# Altium project StepperMotorDriver.PrjPcb
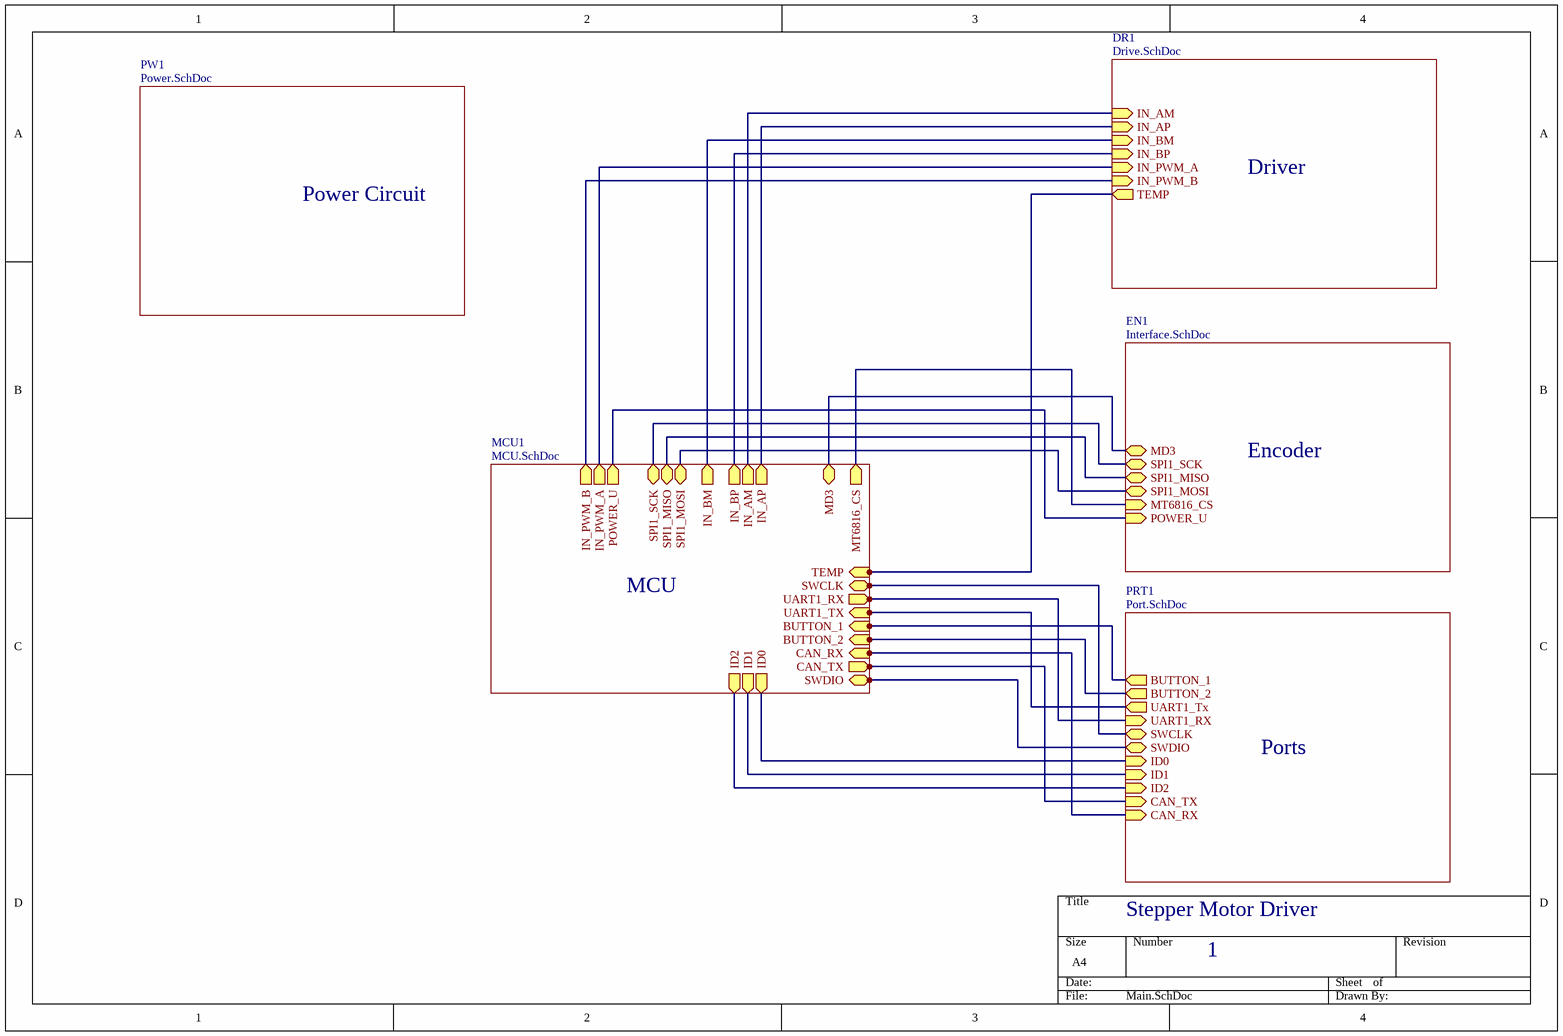
[diagram p0: Main.SchDoc]
6 sheets, 99 parts. Net scope: hierarchical (ports join the sheet entries above them; power ports are global).
Board file: PCB5.PcbDoc
Sheets:
  Main.SchDoc
    MCU1 = MCU.SchDoc
    DR1 = Drive.SchDoc
    EN1 = Interface.SchDoc
    PRT1 = Port.SchDoc
    PW1 = Power.SchDoc

## Sheet Main.SchDoc
size A4; SheetNumber: 1; SheetTotal: 6

### Sub-sheets
DR1 = Drive.SchDoc: IN_AM (in), IN_AP (in), IN_BM (in), IN_BP (in), IN_PWM_A (in), IN_PWM_B (in), TEMP (out)
EN1 = Interface.SchDoc: SPI1_SCK (bidir), SPI1_MISO (bidir), SPI1_MOSI (bidir), MT6816_CS (in), POWER_U (in), MD3 (bidir)
MCU1 = MCU.SchDoc: BUTTON_2 (in), SPI1_SCK (bidir), SPI1_MISO (bidir), SPI1_MOSI (bidir), UART1_TX (in), UART1_RX (out), CAN_RX (in), CAN_TX (out), IN_PWM_B (out), IN_PWM_A (out), BUTTON_1 (in), POWER_U (out), TEMP (in), IN_BM (out), IN_BP (out), IN_AM (out), IN_AP (out), ID0 (out), ID1 (out), ID2 (out), SWDIO (bidir), SWCLK (bidir), MT6816_CS (out), MD3 (bidir)
PRT1 = Port.SchDoc: BUTTON_1 (out), BUTTON_2 (out), UART1_Tx (out), UART1_RX (in), SWCLK (bidir), SWDIO (bidir), ID0 (in), ID1 (in), ID2 (in), CAN_TX (in), CAN_RX (in)
PW1 = Power.SchDoc: no entries

### Nets
NetC10_2: sheet MCU1/POWER_U, sheet EN1/POWER_U
NetC38_2: sheet MCU1/TEMP, sheet DR1/TEMP
NetJ1_5: sheet MCU1/SPI1_SCK, sheet EN1/SPI1_SCK
NetJ1_6: sheet MCU1/SPI1_MISO, sheet EN1/SPI1_MISO
NetJ1_7: sheet MCU1/SPI1_MOSI, sheet EN1/SPI1_MOSI
NetJ2_8: sheet MCU1/ID0, sheet PRT1/ID0
NetJ2_9: sheet MCU1/ID1, sheet PRT1/ID1
NetJ2_10: sheet MCU1/ID2, sheet PRT1/ID2
NetJ3_2: sheet MCU1/UART1_RX, sheet PRT1/UART1_RX
NetJ3_3: sheet MCU1/UART1_TX, sheet PRT1/UART1_Tx
NetJ3_4: sheet MCU1/SWDIO, sheet PRT1/SWDIO
NetJ3_5: sheet MCU1/SWCLK, sheet PRT1/SWCLK
NetR2_1: sheet MCU1/IN_PWM_A, sheet DR1/IN_PWM_A
NetR5_1: sheet MCU1/IN_PWM_B, sheet DR1/IN_PWM_B
NetS2_4: sheet MCU1/BUTTON_1, sheet PRT1/BUTTON_1
NetS3_4: sheet MCU1/BUTTON_2, sheet PRT1/BUTTON_2
NetU1_2: sheet MCU1/IN_AM, sheet DR1/IN_AM
NetU1_3: sheet MCU1/IN_AP, sheet DR1/IN_AP
NetU2_2: sheet MCU1/IN_BM, sheet DR1/IN_BM
NetU2_3: sheet MCU1/IN_BP, sheet DR1/IN_BP
NetU4_45: sheet MCU1/CAN_RX, sheet PRT1/CAN_RX
NetU4_46: sheet MCU1/CAN_TX, sheet PRT1/CAN_TX
(unnamed): sheet MCU1/MT6816_CS, sheet EN1/MT6816_CS
(unnamed): sheet MCU1/MD3, sheet EN1/MD3

### Notes on the sheet
- Driver
- Power Circuit
- Encoder
- MCU
- Ports
- Stepper Motor Driver
- 1

## Sheet MCU.SchDoc
size A4; SheetNumber: 4; SheetTotal: 6
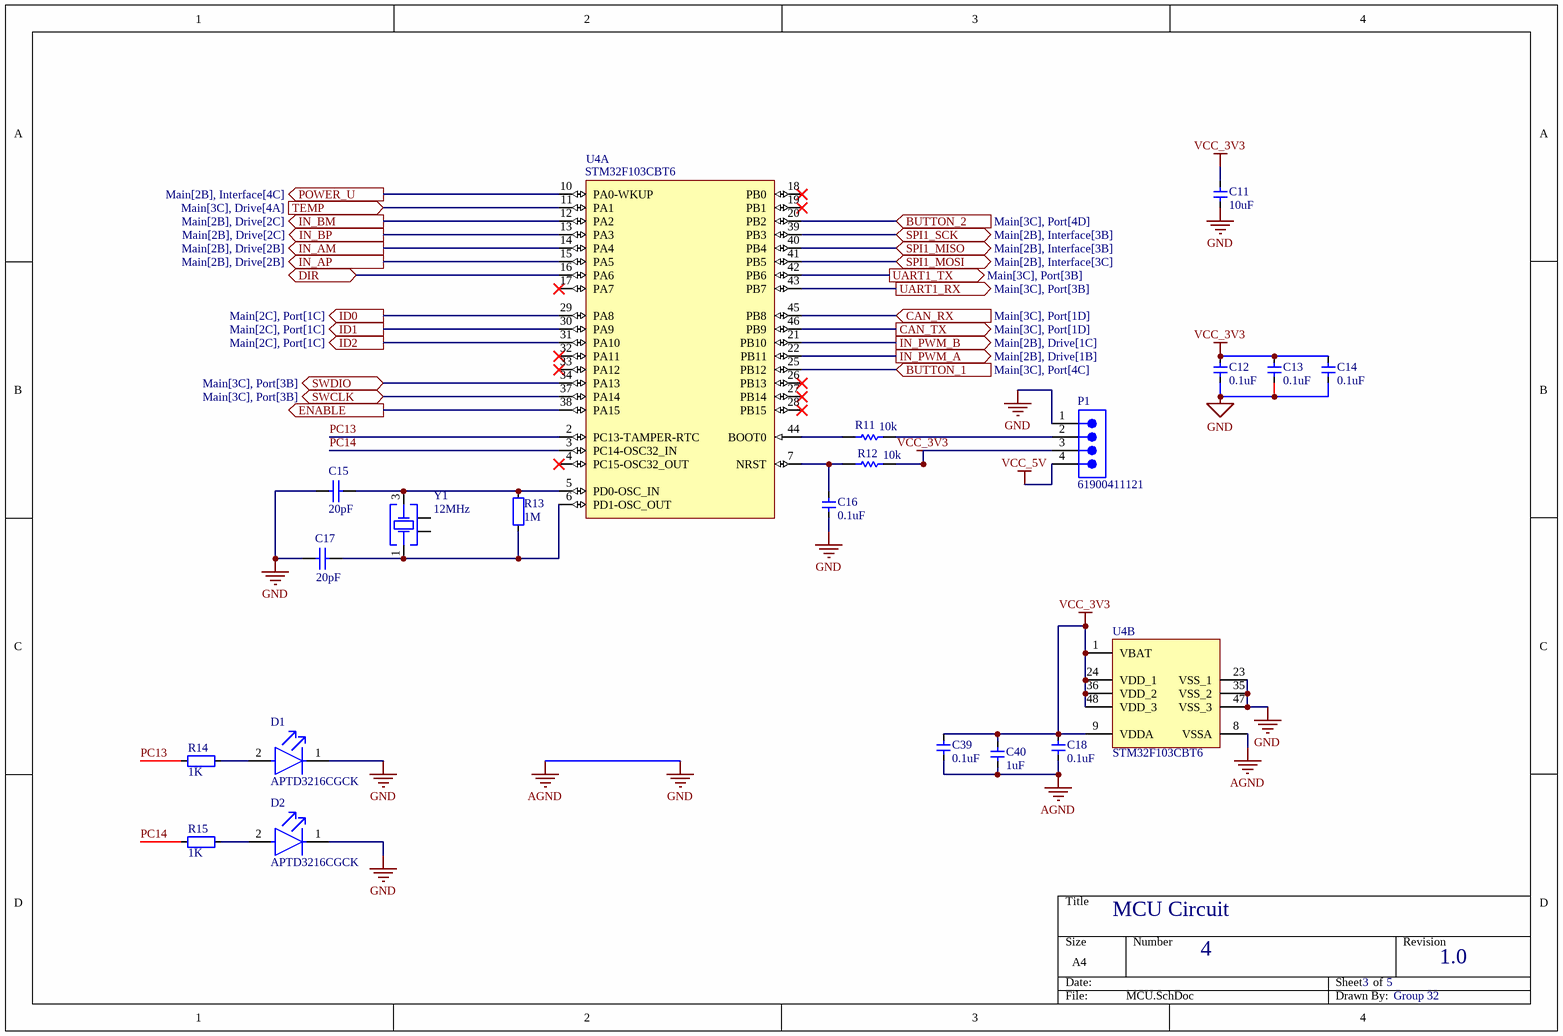
[diagram p1: MCU.SchDoc]

### Parts
C11  10uF  [CAPC2013X94X50LL20T25]
C12  0.1uF  [CAPC2013X94X50LL20T25]
C13  0.1uF  [CAPC2013X94X50LL20T25]
C14  0.1uF  [CAPC2013X94X50LL20T25]
C15  Resistance: 20pF  [CAPC2013X94X50LL20T25]  (hidden comment: 08055A200JAT2A)
C16  0.1uF  [CAPC2013X94X50LL20T25]
C17  Resistance: 20pF  [CAPC2013X94X50LL20T25]  (hidden comment: 08055A200JAT2A)
C18  0.1uF  [CAPC2013X94X50LL20T25]
C39  0.1uF  [CAPC2013X94X50LL20T25]
C40  1uF  [CAPC2013X94X50LL20T25]
D1  APTD3216CGCK  [FP-APTD3216CGCK-MFG]
D2  APTD3216CGCK  [FP-APTD3216CGCK-MFG]
P1  61900411121  [61900411121]
R11  REs: 10k  [RESC2013X60X35NL10T20]  (hidden comment: RC0805FR-0710KL)
R12  REs: 10k  [RESC2013X60X35NL10T20]  (hidden comment: RC0805FR-0710KL)
R13  1M  [RESC2013X60X35NL10T20]
R14  1K  [RESC3116X65N]
R15  1K  [RESC3116X65N]
U4  STM32F103CBT6  [STM-LQFP48_L]  (parts A,B of 2)
Y1  Frequency: 12MHz  [WE-XTAL_CFPX-180]  (hidden comment: 830069944)

### Ports
BUTTON_1 (in, see Main[3C], Port[4C]), BUTTON_2 (in, see Main[3C], Port[4D]), CAN_RX (in, see Main[3C], Port[1D]), CAN_TX (out, see Main[3C], Port[1D]), DIR (bidir), ENABLE (out), ID0 (out, see Main[2C], Port[1C]), ID1 (out, see Main[2C], Port[1C]), ID2 (out, see Main[2C], Port[1C]), IN_AM (out, see Main[2B], Drive[2B]), IN_AP (out, see Main[2B], Drive[2B]), IN_BM (out, see Main[2B], Drive[2C]), IN_BP (out, see Main[2B], Drive[2C]), IN_PWM_A (out, see Main[2B], Drive[1B]), IN_PWM_B (out, see Main[2B], Drive[1C]), POWER_U (out, see Main[2B], Interface[4C]), SPI1_MISO (bidir, see Main[2B], Interface[3B]), SPI1_MOSI (bidir, see Main[2B], Interface[3C]), SPI1_SCK (bidir, see Main[2B], Interface[3B]), SWCLK (bidir, see Main[3C], Port[3B]), SWDIO (bidir, see Main[3C], Port[3B]), TEMP (in, see Main[3C], Drive[4A]), UART1_RX (out, see Main[3C], Port[3B]), UART1_TX (out, see Main[3C], Port[3B])

### Nets
AGND: C11.1 C12.1 C13.1 C14.1 C15.1 C16.1 C17.1 C18.1 C39.1 C40.1 D1.1(C) D2.1(C) P1.1 U4.8(VSSA) U4.23(VSS_1) U4.35(VSS_2) U4.47(VSS_3)  [also labelled GND]
VCC_3V3: C11.2 C12.2 C13.2 C14.2 C18.2 C39.2 C40.2 P1.3 R12.2 U4.1(VBAT) U4.9(VDDA) U4.24(VDD_1) U4.36(VDD_2) U4.48(VDD_3)
VCC_5V: P1.4
PC13: R14.1 U4.2(PC13-TAMPER-RTC)
PC14: R15.1 U4.3(PC14-OSC32_IN)
NetC10_2: U4.10(PA0-WKUP) ; port POWER_U
NetC15_2: C15.2 R13.2 U4.5(PD0-OSC_IN) Y1.3(Crystal)
NetC16_2: C16.2 R12.1 U4.7(NRST)
NetC17_2: C17.2 R13.1 U4.6(PD1-OSC_OUT) Y1.1(Crystal)
NetC38_2: U4.11(PA1) ; port TEMP
NetD1_2: D1.2(A) R14.2
NetD2_2: D2.2(A) R15.2
NetJ1_5: U4.39(PB3) ; port SPI1_SCK
NetJ1_6: U4.40(PB4) ; port SPI1_MISO
NetJ1_7: U4.41(PB5) ; port SPI1_MOSI
NetJ2_8: U4.29(PA8) ; port ID0
NetJ2_9: U4.30(PA9) ; port ID1
NetJ2_10: U4.31(PA10) ; port ID2
NetJ3_2: U4.43(PB7) ; port UART1_RX
NetJ3_3: U4.42(PB6) ; port UART1_TX
NetJ3_4: U4.34(PA13) ; port SWDIO
NetJ3_5: U4.37(PA14) ; port SWCLK
NetP1_2: P1.2 R11.2
NetR2_1: U4.22(PB11) ; port IN_PWM_A
NetR5_1: U4.21(PB10) ; port IN_PWM_B
NetR11_1: R11.1 U4.44(BOOT0)
NetS2_4: U4.25(PB12) ; port BUTTON_1
NetS3_4: U4.20(PB2) ; port BUTTON_2
NetU1_2: U4.14(PA4) ; port IN_AM
NetU1_3: U4.15(PA5) ; port IN_AP
NetU2_2: U4.12(PA2) ; port IN_BM
NetU2_3: U4.13(PA3) ; port IN_BP
NetU4_16: U4.16(PA6) ; port DIR
NetU4_38: U4.38(PA15) ; port ENABLE
NetU4_45: U4.45(PB8) ; port CAN_RX
NetU4_46: U4.46(PB9) ; port CAN_TX

Not connected (* = marked no-connect by the designer): U4 4(PC15-OSC32_OUT)* 17(PA7)* 18(PB0)* 19(PB1)* 26(PB13)* 27(PB14)* 28(PB15)* 32(PA11)* 33(PA12)*; Y1 2(GND&Lid) 4(GND&Lid)

### Notes on the sheet
- MCU Circuit
- 4
- 3
- 5
- 1.0
- Group 32

### Library data of the parts
C11-C14 C16 C18 C39 = 电容-0402: Capacitor; Value: 0.1u
C15 C17 = CMP-2007-04294-1: Manufacturer: AVX Interconnect / Elco; Part Number: 08055A200JAT2A
C40 = 电容-0402: Capacitor; Value: 1u
D1 D2 = CMP-2000-05792-2: LED GREEN CLEAR 2SMD; Forward Voltage: 2.1V; Forward Current: 20mA; Luminous Intensity: 300mcd; Number of LEDs: 1; Dominant Wavelength: 570nm; Viewing Angle: 50°; Lead Free: Lead Free; Lens Color: Clear; Mount: Surface Mount; Package Quantity: 2000; Height: 1.8mm; Number of Pins: 2; Test Current: 20mA; Case Code (Metric): 3216; Case/Package: 1206; Case Code (Imperial): 1206; Illumination Color: Green; Color: Green; Width: 1.6mm; Packaging: Tape and Reel; Min Operating Temperature: -40°C; Lens Style: Clear; Max Operating Temperature: 85°C; Length: 3.2mm
P1 = CMP-1502-00586-2: NexarPartId: 18818226; Connector Type: Male Pin; Insulation: Insulated; Number of Positions: 4; Gender: Male; Operating Supply Voltage: 250V; Pitch: 2.54mm; Current Rating: 3A; Insulation Resistance: 1GΩ; Contact Resistance: 20mΩ; Termination: Through Hole; Contact Material: Copper; Height: 3.3mm; Width: 10.2mm; RoHS: Compliant; REACH SVHC: Unknown; Max Operating Temperature: 105°C; Contact Plating: Tin; Lead Free: Lead Free; Contact Gender: Male; Lead Pitch: 2.54mm; Flammability Rating: UL94 V-0; Packaging: Bulk; Housing Material: Nylon; Number of Pins: 4; Number of Contacts: 4; Color: Beige; Number of Rows: 1; Orientation: Vertical; Contact Mating Length: 7.493mm; Mount: Through Hole; Min Operating Temperature: -40°C; Voltage Rating: 250V; Fastening Type: Friction; Length: 10.16mm
R11 R12 = CMP-1659-00013-4: Chip Resistor, 10 KOhm, +/- 1%, 0.125 W, -55 to 155 degC, 0805 (2012 Metric), RoHS, Tape and Reel; Manufacturer: Yageo; Voltage Rating: 150 V; Mount: Surface Mount; ComponentLink1Description: Manufacturer URL; ComponentLink2URL: http://www.yageo.com/documents/recent/PYu-RC_Group_51_RoHS_L_04.pdf; Pins: 2; Length: 2 mm; Min Operating Temperature: -55 degC; Height: 0.5 mm; Mounting Technology: Surface Mount; RoHSCompliant: true; REACH SVHC: No SVHC; ComponentLink1URL: http://www.yageo.com/; Max Operating Temperature: 155 degC; PackageReference: 0805; DatasheetVersion: Rev. 4, 02/2016; Package Quantity: 5000; Packaging: Tape and Reel; ComponentLink2Description: Datasheet; PackageDescription: 2-Pin Surface Mounted Device, Body 2 x 1.25 mm
R13-R15 = 电阻-0402: Resistor; Value: 22R
U4 = CMP-0237-00250-3: ARM Cortex-M3 32-bit MCU, 128 KB Flash, 20 KB Internal RAM, 37 I/Os, 48-pin LQFP, -40 to 85 degC, Tray; Supply Voltage(Vcc) min (V): 2; Operating Frequency(F) (Processor speed) (MHz): 72; A/D Converter: 2x12-bit (10 Channel); FLASH Size (Prog) (kB): 128; Internal RAM Size (kB): 20; I/Os (High Current): 37; ComponentLink2Description: Datasheet; PackageReference: LQFP48; PartNumber: STM32F103CBT6; ComponentLink1Description: Manufacturer URL; DatasheetVersion: Rev. 16; PackageVersion: Rev. 6, 06/2013; Packing: Tray; ComponentLink1URL: http://www.st.com/web/en/home.html; Mounting Technology: Surface Mount; ComponentLink3URL: http://www.st.com/st-web-ui/static/active/en/resource/technical/document/datasheet/DM00058181.pdf; PackageDescription: 48-Pin Low Profile Quad Flat Package, 7 x 7 mm Body, 0.5 mm Pitch; Core: ARM Cortex-M3; ComponentLink3Description: Package Specification; ComponentLink2URL: http://www.st.com/st-web-ui/static/active/en/resource/technical/document/datasheet/CD00161566.pdf
Y1 = CMP-03913-116876513-1: 830069944 WE-XTAL Quartz Crystal; Length: 3.2mm; Height: 800µm; Max Operating Temperature: 85°C; NexarPartId: 116876513; Min Operating Temperature: -40°C; Width: 2.5mm

## Sheet Drive.SchDoc
size A4; SheetNumber: 2; SheetTotal: 6
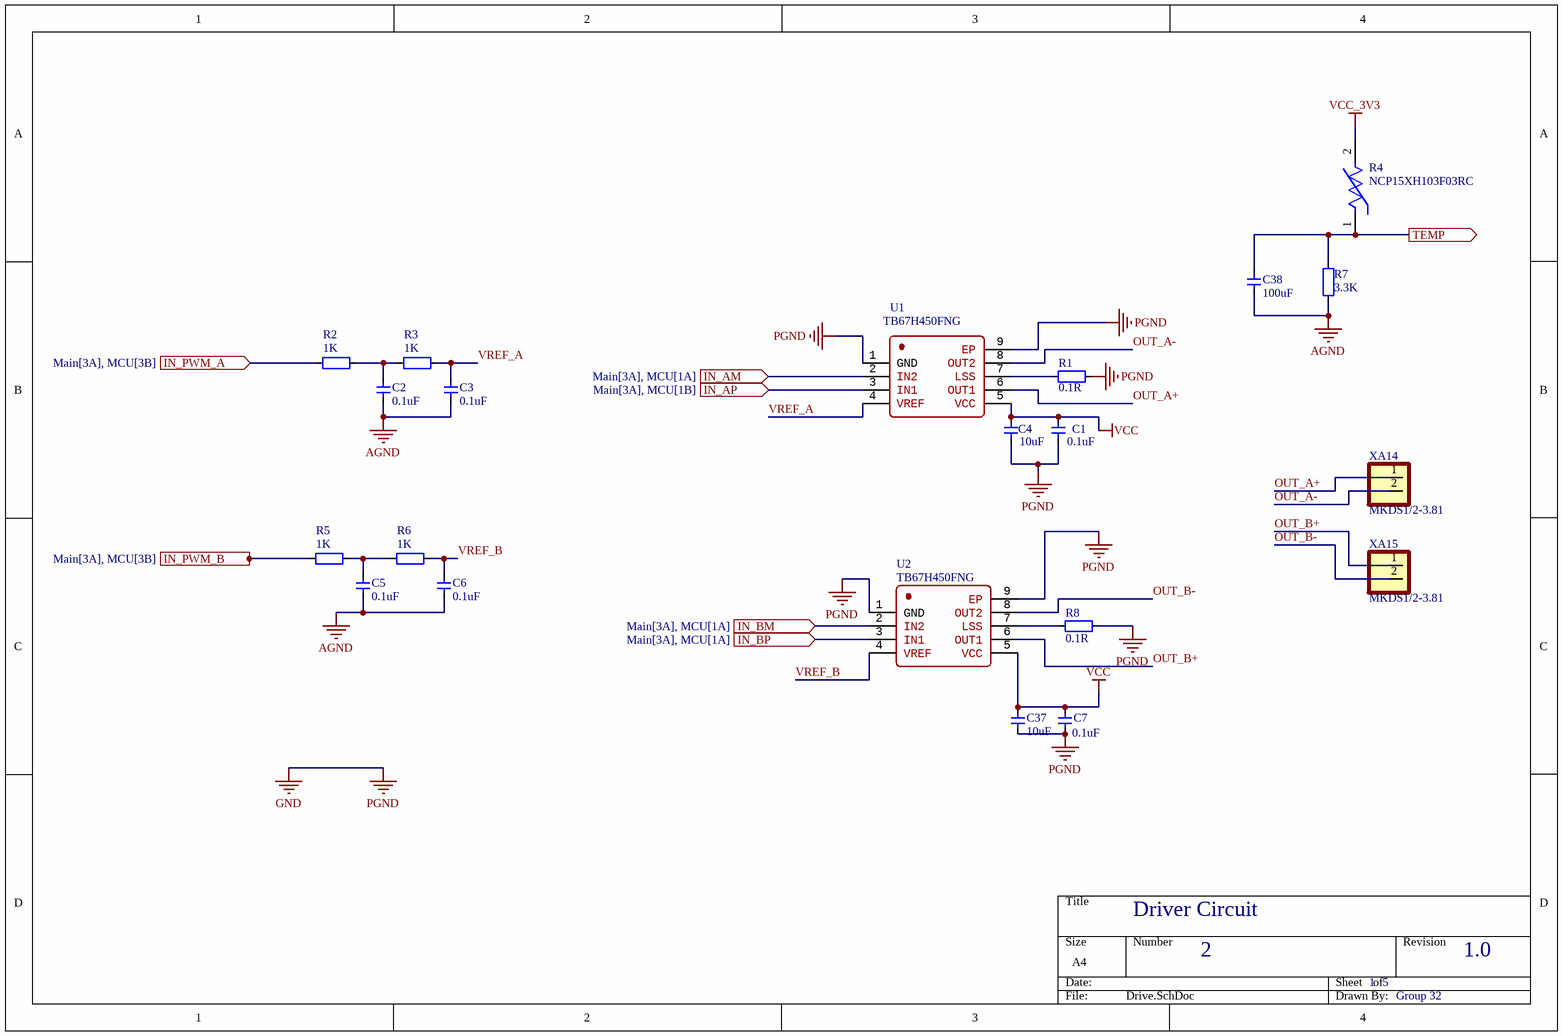
[diagram p2: Drive.SchDoc]

### Parts
C1  0.1uF  [CAPC2013X94X50LL20T25]
C2  0.1uF  [CAPC2013X94X50LL20T25]
C3  0.1uF  [CAPC2013X94X50LL20T25]
C4  10uF  [CAPC2013X94X50LL20T25]
C5  0.1uF  [CAPC2013X94X50LL20T25]
C6  0.1uF  [CAPC2013X94X50LL20T25]
C7  0.1uF  [CAPC2013X94X50LL20T25]
C37  10uF  [CAPC2013X94X50LL20T25]
C38  100uF  [CAPC3216X190N]
R1  0.1R  [RESC3116X65N]
R2  1K  [RESC3116X65N]
R3  1K  [RESC3116X65N]
R4  NCP15XH103F03RC  [FP-NCP15-NCU15-0_05-IPC_C]
R5  1K  [RESC3116X65N]
R6  1K  [RESC3116X65N]
R7  3.3K  [RESC2013X60X35NL10T20]
R8  0.1R  [RESC3116X65N]
U1  TB67H450FNG  [SOIC127P599X175-9N]
U2  TB67H450FNG  [SOIC127P599X175-9N]
XA14  MKDS1/2-3.81  [PHOENIX_MKDS1/2-3.81 - duplicate]
XA15  MKDS1/2-3.81  [PHOENIX_MKDS1/2-3.81 - duplicate]

### Ports
IN_AM (in, see Main[3A], MCU[1A]), IN_AP (in, see Main[3A], MCU[1B]), IN_BM (in, see Main[3A], MCU[1A]), IN_BP (in, see Main[3A], MCU[1A]), IN_PWM_A (in, see Main[3A], MCU[3B]), IN_PWM_B (in, see Main[3A], MCU[3B]), TEMP (out, see Main[3A], MCU[1A])

### Nets
AGND: C1.1 C2.1 C3.1 C4.1 C5.1 C6.1 C7.1 C37.1 C38.1 R1.2 R7.1 R8.2 U1.1(GND) U1.9(EP) U2.1(GND) U2.9(EP)  [also labelled GND, PGND]
VCC: C1.2 C4.2 C7.2 C37.2 U1.5(VCC) U2.5(VCC)
VCC_3V3: R4.2
OUT_A+: U1.6(OUT1) XA14.1
OUT_A-: U1.8(OUT2) XA14.2
OUT_B+: U2.6(OUT1) XA15.1
OUT_B-: U2.8(OUT2) XA15.2
VREF_A: C3.2 R3.2 U1.4(VREF)
VREF_B: C6.2 R6.2 U2.4(VREF)
NetC2_2: C2.2 R2.2 R3.1
NetC5_2: C5.2 R5.2 R6.1
NetC38_2: C38.2 R4.1 R7.2 ; port TEMP
NetR1_1: R1.1 U1.7(LSS)
NetR2_1: R2.1 ; port IN_PWM_A
NetR5_1: R5.1 ; port IN_PWM_B
NetR8_1: R8.1 U2.7(LSS)
NetU1_2: U1.2(IN2) ; port IN_AM
NetU1_3: U1.3(IN1) ; port IN_AP
NetU2_2: U2.2(IN2) ; port IN_BM
NetU2_3: U2.3(IN1) ; port IN_BP

### Notes on the sheet
- Driver Circuit
- 2
- 1
- 5
- 1.0
- Group 32

### Library data of the parts
C1-C7 C37 = 电容-0402: Capacitor; Value: 0.1u
C38 = 电容-0402: Capacitor; Value: 100uF
R1 R8 = 电阻-1206: Resistor; Value: 22R
R2 R3 R5-R7 = 电阻-0402: Resistor; Value: 22R
R4 = CMP-06022-000003-3: NTC Thermistor for Temperature Sensor, 0402, 10kΩ, 1%, 0.1mA, 5V; Max Power Dissipation: 100mW; Resistance: 10kR; Current Rating: 310uA; Length: 1mm; Min Operating Temperature: -40°C; Max Operating Temperature: 125°C; Resistance Tolerance: 1%; Lead Free: Lead Free; Radiation Hardening: No; Case Code (Imperial): 0402; Depth: 0.5mm; Tolerance: 1%; Packaging: Tape and Reel; Package Quantity: 10000; Series: NCP; Number of Pins: 2; Power Rating: 100mW; Case/Package: 0402; Case Code (Metric): 1005; Height: 0.5mm; Termination: SMD/SMT; RoHS Compliant: Yes; REACH SVHC: No SVHC; Mount: Surface Mount
U1 U2 = TB67H450FNG: PWM Chopper Type DC Brushed Motor Driver
XA14 XA15 = MKDS1/2-3.81: 2 Position Wire to Board Terminal Block Horizontal with Board 0.150 _3.81mm_ Through Hole; MF: Phoenix Contact; Package: None; Price: None; SnapEDA_Link: https://www.snapeda.com/parts/MKDS%201/%202-3.81/Phoenix%20Contact/view-part/114562/?ref=snap; Availability: Unavailable; Value: *; MP: MKDS 1/ 2-3.81

## Sheet Interface.SchDoc
size A4; SheetNumber: 3; SheetTotal: 6
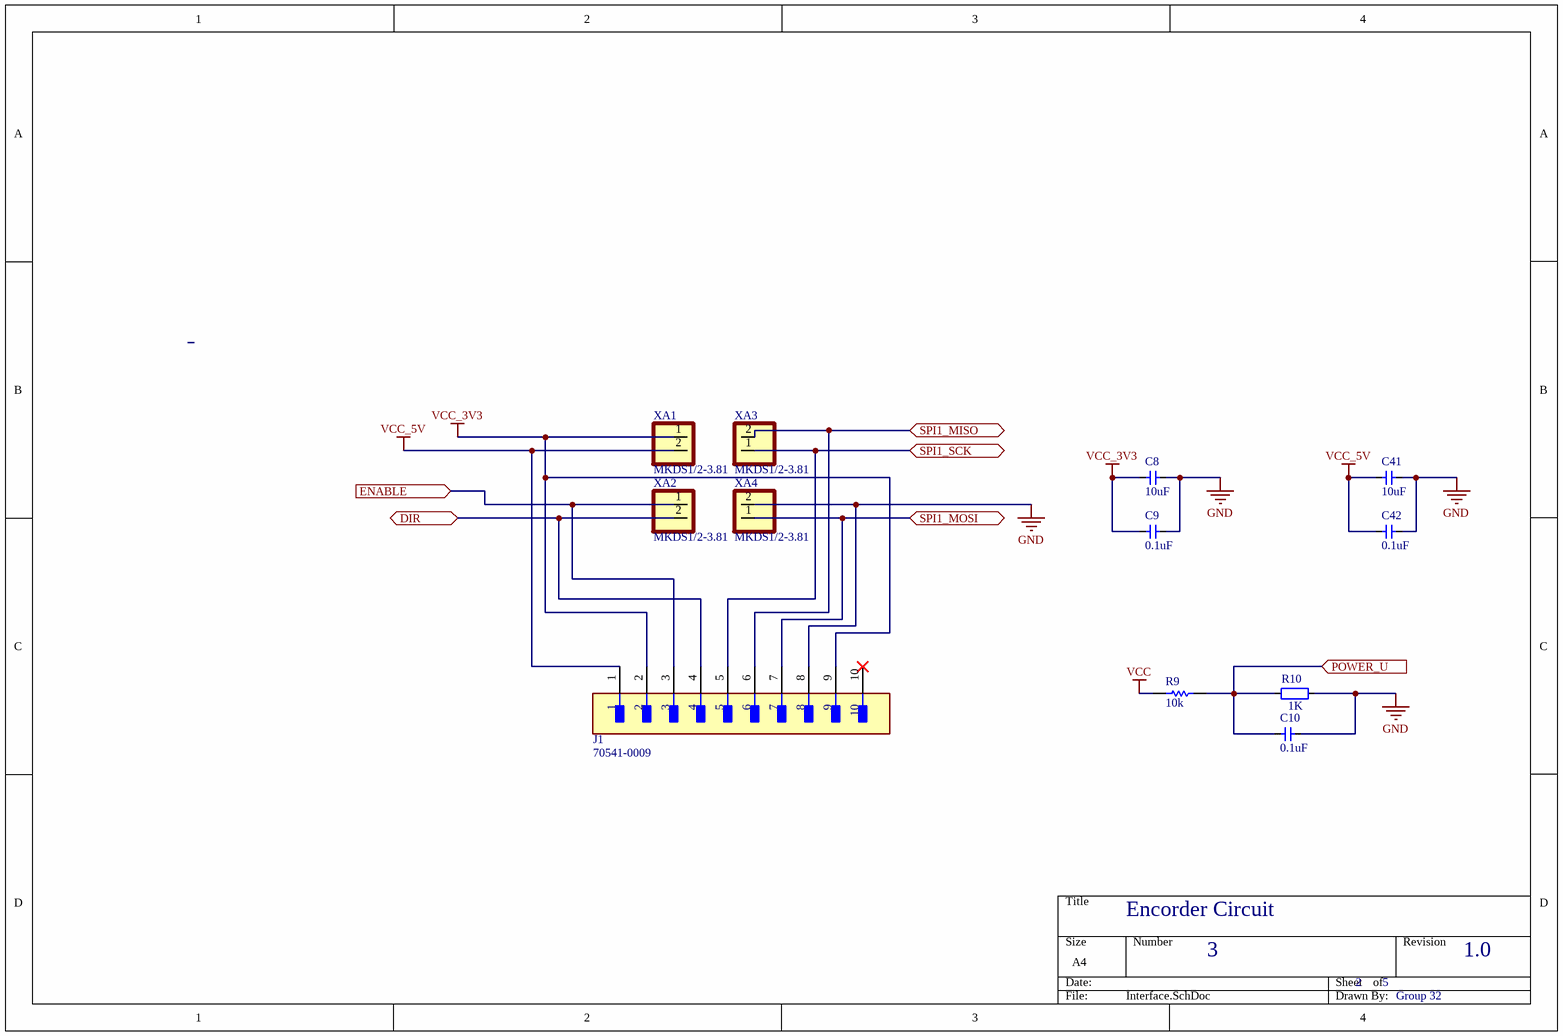
[diagram p3: Interface.SchDoc]

### Parts
C8  10uF  [CAPC2013X94X50LL20T25]
C9  0.1uF  [CAPC2013X94X50LL20T25]
C10  0.1uF  [CAPC2013X94X50LL20T25]
C41  10uF  [CAPC2013X94X50LL20T25]
C42  0.1uF  [CAPC2013X94X50LL20T25]
J1  70541-0009  [FP-70541-0009-MFG]
R9  REs: 10k  [RESC2013X60X35NL10T20]  (hidden comment: RC0805FR-0710KL)
R10  1K  [RESC3116X65N]
XA1  MKDS1/2-3.81  [PHOENIX_MKDS1/2-3.81 - duplicate]
XA2  MKDS1/2-3.81  [PHOENIX_MKDS1/2-3.81 - duplicate]
XA3  MKDS1/2-3.81  [PHOENIX_MKDS1/2-3.81 - duplicate]
XA4  MKDS1/2-3.81  [PHOENIX_MKDS1/2-3.81 - duplicate]

### Ports
DIR (bidir), ENABLE (in), POWER_U (in, see Main[3C], MCU[1A]), SPI1_MISO (bidir, see Main[3B], MCU[3A]), SPI1_MOSI (bidir, see Main[3B], MCU[3B]), SPI1_SCK (bidir, see Main[3B], MCU[3A])

### Nets
GND: C8.1 C9.1 C10.1 C41.1 C42.1 J1.8 R10.2 XA4.2  [project net AGND]
VCC: R9.1
VCC_3V3: C8.2 C9.2 J1.2 J1.9 XA1.1
VCC_5V: C41.2 C42.2 J1.1 XA1.2
NetC10_2: C10.2 R9.2 R10.1 ; port POWER_U
NetJ1_3: J1.3 XA2.1 ; port ENABLE
NetJ1_4: J1.4 XA2.2 ; port DIR
NetJ1_5: J1.5 XA3.1 ; port SPI1_SCK
NetJ1_6: J1.6 XA3.2 ; port SPI1_MISO
NetJ1_7: J1.7 XA4.1 ; port SPI1_MOSI

Not connected (* = marked no-connect by the designer): J1 10*

### Notes on the sheet
- Encorder Circuit
- 3
- 2
- 5
- 1.0
- Group 32

### Library data of the parts
C8-C10 C41 C42 = 电容-0402: Capacitor; Value: 0.1u
J1 = CMP-04776-001054-1: CONN HEADER VERT 10POS 2.54MM; Current Rating: 3A; Number of Positions: 10; Contact Post Length: 3.3mm; Voltage Rating: 250V; Contact Resistance: 15mR; Glow Wire Compliant: Non-compliant; Series: 70541; Pitch: 2.54mm; Orientation: Vertical; Contact Material: Bronze; Number of Rows: 1; Min Operating Temperature: -40°C; Flammability Rating: UL94 V-0; Number of Contacts: 10; Packaging: Rail/Tube; Contact Plating: Tin; Number of Circuits: 10; Housing Material: Polyester; Termination: Through Hole; Material: Brass; Max Operating Temperature: 105°C; Package Quantity: 768; Mount: Through Hole; Contact Mating Length: 6.1mm; ELV: Compliant; Contact Gender: Male
R9 = CMP-1659-00013-4: as R11 on sheet MCU; Mount: Surface Mount; ComponentLink1Description: Manufacturer URL; ComponentLink2URL: http://www.yageo.com/documents/recent/PYu-RC_Group_51_RoHS_L_04.pdf; Pins: 2; Length: 2 mm; Min Operating Temperature: -55 degC; Height: 0.5 mm; Mounting Technology: Surface Mount; RoHSCompliant: true; REACH SVHC: No SVHC; ComponentLink1URL: http://www.yageo.com/; Max Operating Temperature: 155 degC; PackageReference: 0805; DatasheetVersion: Rev. 4, 02/2016; Package Quantity: 5000; Packaging: Tape and Reel; ComponentLink2Description: Datasheet; PackageDescription: 2-Pin Surface Mounted Device, Body 2 x 1.25 mm
R10 = 电阻-0402: Resistor; Value: 22R
XA1-XA4 = MKDS1/2-3.81: as XA14 on sheet Drive; Package: None; Price: None; SnapEDA_Link: https://www.snapeda.com/parts/MKDS%201/%202-3.81/Phoenix%20Contact/view-part/114562/?ref=snap; Availability: Unavailable; Value: *; MP: MKDS 1/ 2-3.81

## Sheet Port.SchDoc
size A4; SheetNumber: 5; SheetTotal: 6
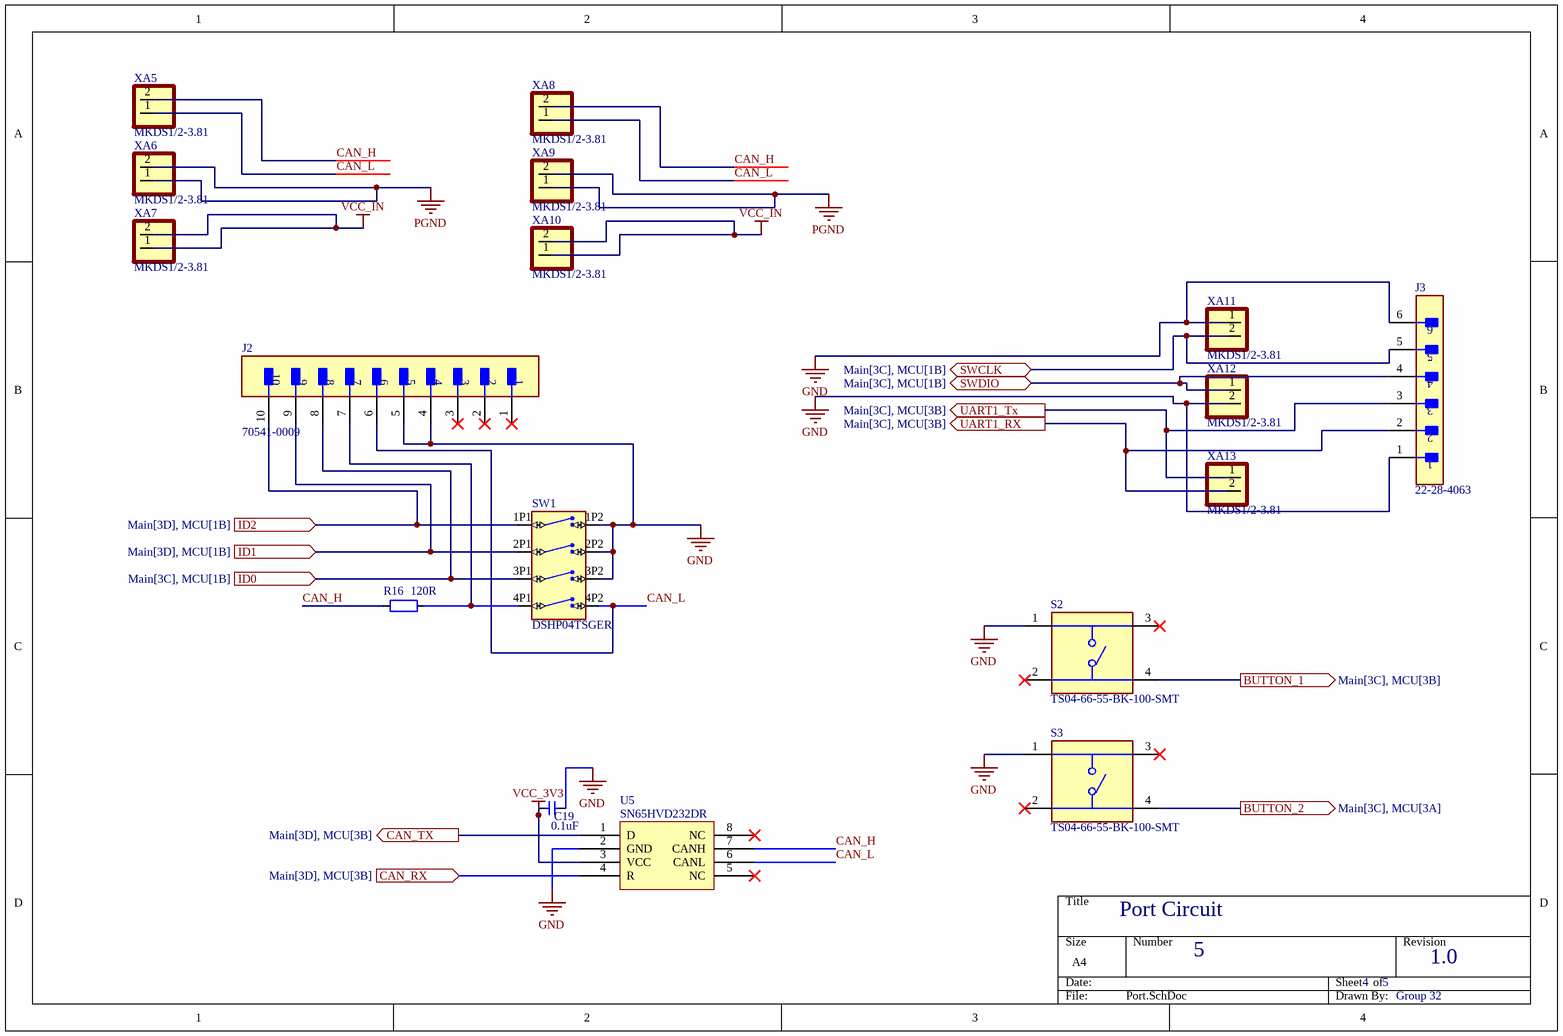
[diagram p4: Port.SchDoc]

### Parts
C19  0.1uF  [CAPC2013X94X50LL20T25]
J2  70541-0009  [FP-70541-0009-MFG]
J3  22-28-4063  [FP-22-28-4063-MFG]
R16  120R  [RESC3116X65N]
S2  TS04-66-55-BK-100-SMT  [SW_TS04-66-55-BK-100-SMT]
S3  TS04-66-55-BK-100-SMT  [SW_TS04-66-55-BK-100-SMT]
SW1  DSHP04TSGER  [DSHP04TSGER]
U5  Manufacturer Part Number: SN65HVD232DR  [SOIC127P599X175-8N]  (hidden comment: SN65HVD232D)
XA5  MKDS1/2-3.81  [PHOENIX_MKDS1/2-3.81 - duplicate]
XA6  MKDS1/2-3.81  [PHOENIX_MKDS1/2-3.81 - duplicate]
XA7  MKDS1/2-3.81  [PHOENIX_MKDS1/2-3.81 - duplicate]
XA8  MKDS1/2-3.81  [PHOENIX_MKDS1/2-3.81 - duplicate]
XA9  MKDS1/2-3.81  [PHOENIX_MKDS1/2-3.81 - duplicate]
XA10  MKDS1/2-3.81  [PHOENIX_MKDS1/2-3.81 - duplicate]
XA11  MKDS1/2-3.81  [PHOENIX_MKDS1/2-3.81 - duplicate]
XA12  MKDS1/2-3.81  [PHOENIX_MKDS1/2-3.81 - duplicate]
XA13  MKDS1/2-3.81  [PHOENIX_MKDS1/2-3.81 - duplicate]

### Ports
BUTTON_1 (out, see Main[3C], MCU[3B]), BUTTON_2 (out, see Main[3C], MCU[3A]), CAN_RX (in, see Main[3D], MCU[3B]), CAN_TX (out, see Main[3D], MCU[3B]), ID0 (in, see Main[3C], MCU[1B]), ID1 (in, see Main[3D], MCU[1B]), ID2 (in, see Main[3D], MCU[1B]), SWCLK (bidir, see Main[3C], MCU[1B]), SWDIO (bidir, see Main[3C], MCU[1B]), UART1_RX (out, see Main[3C], MCU[3B]), UART1_Tx (out, see Main[3C], MCU[3B])

### Nets
GND: C19.1 J2.4 J2.5 J3.1 J3.6 S2.1 S3.1 SW1.1P2 SW1.2P2 SW1.3P2 U5.2(GND) XA6.1 XA6.2 XA9.1 XA9.2 XA11.1 XA12.2  [also labelled PGND]  [project net AGND]
VCC_3V3: C19.2 U5.3(VCC)
VCC_IN: XA7.1 XA7.2 XA10.1 XA10.2
CAN_H: R16.1 U5.7(CANH) XA5.2 XA8.2
CAN_L: J2.6 SW1.4P2 U5.6(CANL) XA5.1 XA8.1
NetJ2_7: J2.7 R16.2 SW1.4P1
NetJ2_8: J2.8 SW1.3P1 ; port ID0
NetJ2_9: J2.9 SW1.2P1 ; port ID1
NetJ2_10: J2.10 SW1.1P1 ; port ID2
NetJ3_2: J3.2 XA13.2 ; port UART1_RX
NetJ3_3: J3.3 XA13.1 ; port UART1_Tx
NetJ3_4: J3.4 XA12.1 ; port SWDIO
NetJ3_5: J3.5 XA11.2 ; port SWCLK
NetS2_4: S2.4 ; port BUTTON_1
NetS3_4: S3.4 ; port BUTTON_2
NetU4_45: U5.4(R) ; port CAN_RX
NetU4_46: U5.1(D) ; port CAN_TX

Not connected (* = marked no-connect by the designer): J2 1* 2* 3*; S2 2* 3*; S3 2* 3*; U5 5(NC)* 8(NC)*

### Notes on the sheet
- Port Circuit
- 5
- 4
- 1.0
- Group 32

### Library data of the parts
C19 = 电容-0402: Capacitor; Value: 0.1u
J2 = CMP-04776-001054-1: as J1 on sheet Interface; Series: 70541; Pitch: 2.54mm; Orientation: Vertical; Contact Material: Bronze; Number of Rows: 1; Min Operating Temperature: -40°C; Flammability Rating: UL94 V-0; Number of Contacts: 10; Packaging: Rail/Tube; Contact Plating: Tin; Number of Circuits: 10; Housing Material: Polyester; Termination: Through Hole; Material: Brass; Max Operating Temperature: 105°C; Package Quantity: 768; Mount: Through Hole; Contact Mating Length: 6.1mm; ELV: Compliant; Contact Gender: Male
J3 = CMP-04776-000885-1: CONN HEADER VERT 6POS 2.54MM; Number of Circuits: 6; Voltage Rating (DC): 250V; Connector Type: Male Pin; Contact Resistance: 20mR; Glow Wire Compliant: Non-compliant; Gender: Male; Current Rating: 4A; Max Voltage Rating (DC): 250.25kV; Series: KK® 42375; Termination: Solder; Orientation: Straight; Max Operating Temperature: 75°C; Min Operating Temperature: 0°C; Mount: Through Hole; Depth: 2.49mm; Contact Material: Brass; Number of Positions: 6; Contact Mating Length: 0.24inch; Number of Rows: 1; Housing Color: Black; Max Voltage Rating (AC): 250V; Housing Material: Thermoplastic; Packaging: Bulk; Contact Plating: Gold; Contact Type: Male Pin; Package Quantity: 1; Number of Contacts: 6; Voltage Rating: 250V; Lead Free: Lead Free; RoHS Compliant: Yes; Pitch: 2.54mm; Color: Black; Flammability Rating: UL94 V-0; Radiation Hardening: No
R16 = 电阻-0402: Resistor; Value: 22R
S2 S3 = TS04-66-55-BK-100-SMT: 6 x 6 mm, 4.3~9.5 mm Actuator Height, 100~260 gf, Surface Mount, SPST, Tactile Switch; MF: CUI Devices; Value: *; MP: TS04-66-55-BK-100-SMT; Package: None; Purchase-URL: https://pricing.snapeda.com/search/part/TS04-66-55-BK-100-SMT/?ref=eda; Price: None; Check_prices: https://www.snapeda.com/parts/TS04-66-55-BK-100-SMT/CUI+Devices/view-part/?ref=eda; CUI_purchase_URL: https://www.cuidevices.com/product/switches/tactile-switches/ts04-series?utm_source=snapeda.com&utm_medium=referral&utm_campaign=snapedaBOM; Availability: In Stock; SnapEDA_Link: https://www.snapeda.com/parts/TS04-66-55-BK-100-SMT/CUI+Devices/view-part/?ref=snap
SW1 = DSHP04TSGER: Switch DIP ON OFF SPST 4 Recessed Slide 0.025A 24VDC Gull Wing 1000Cycles 1.27mm SMD T/R; MF: KINGTEK INDUSTRIAL; MP: DSHP04TSGER; Package: None; Check_prices: https://www.snapeda.com/parts/DSHP04TSGER/GTE/view-part/?ref=eda; SnapEDA_Link: https://www.snapeda.com/parts/DSHP04TSGER/GTE/view-part/?ref=snap; Availability: In Stock; Price: None; Value: *
U5 = SN65HVD232D: Manufacturer: Texas Instruments; Protocol: CAN; Number of Drivers/Receivers: 1/1; Duplex: Half; Data Rate: 1Mbps; Voltage - Supply: 3 V ~ 3.6 V; Supplier 1: Digi-Key; Supplier Part Number 1: 296-26344-2-ND; RoHS: RoHS Compliant; Category: Integrated Circuits (ICs); Stock: 5000; Pricing 1: 2500=0.84375 (USD); Packaging: Tape & Reel (TR); Part Status: Active; Type: Transceiver; Operating Temperature: -40°C ~ 85°C; Mounting Type: Surface Mount; Package / Case: 8-SOIC (0.154", 3.90mm Width); Supplier Device Package: 8-SOIC; ComponentLink1URL: http://www.ti.com/lit/ds/symlink/sn65hvd230.pdf; ComponentLink1Description: http://www.ti.com/lit/ds/symlink/sn65hvd230.pdf; Supplier 2: Digi-Key; Supplier Part Number 2: 296-26344-1-ND; Pricing 2: 1=2.05, 10=1.842, 100=1.4809, 500=1.21668, 1000=1.00811 (USD)
XA5-XA13 = MKDS1/2-3.81: as XA14 on sheet Drive; Package: None; Price: None; SnapEDA_Link: https://www.snapeda.com/parts/MKDS%201/%202-3.81/Phoenix%20Contact/view-part/114562/?ref=snap; Availability: Unavailable; Value: *; MP: MKDS 1/ 2-3.81

## Sheet Power.SchDoc
size A4; SheetNumber: 6; SheetTotal: 6
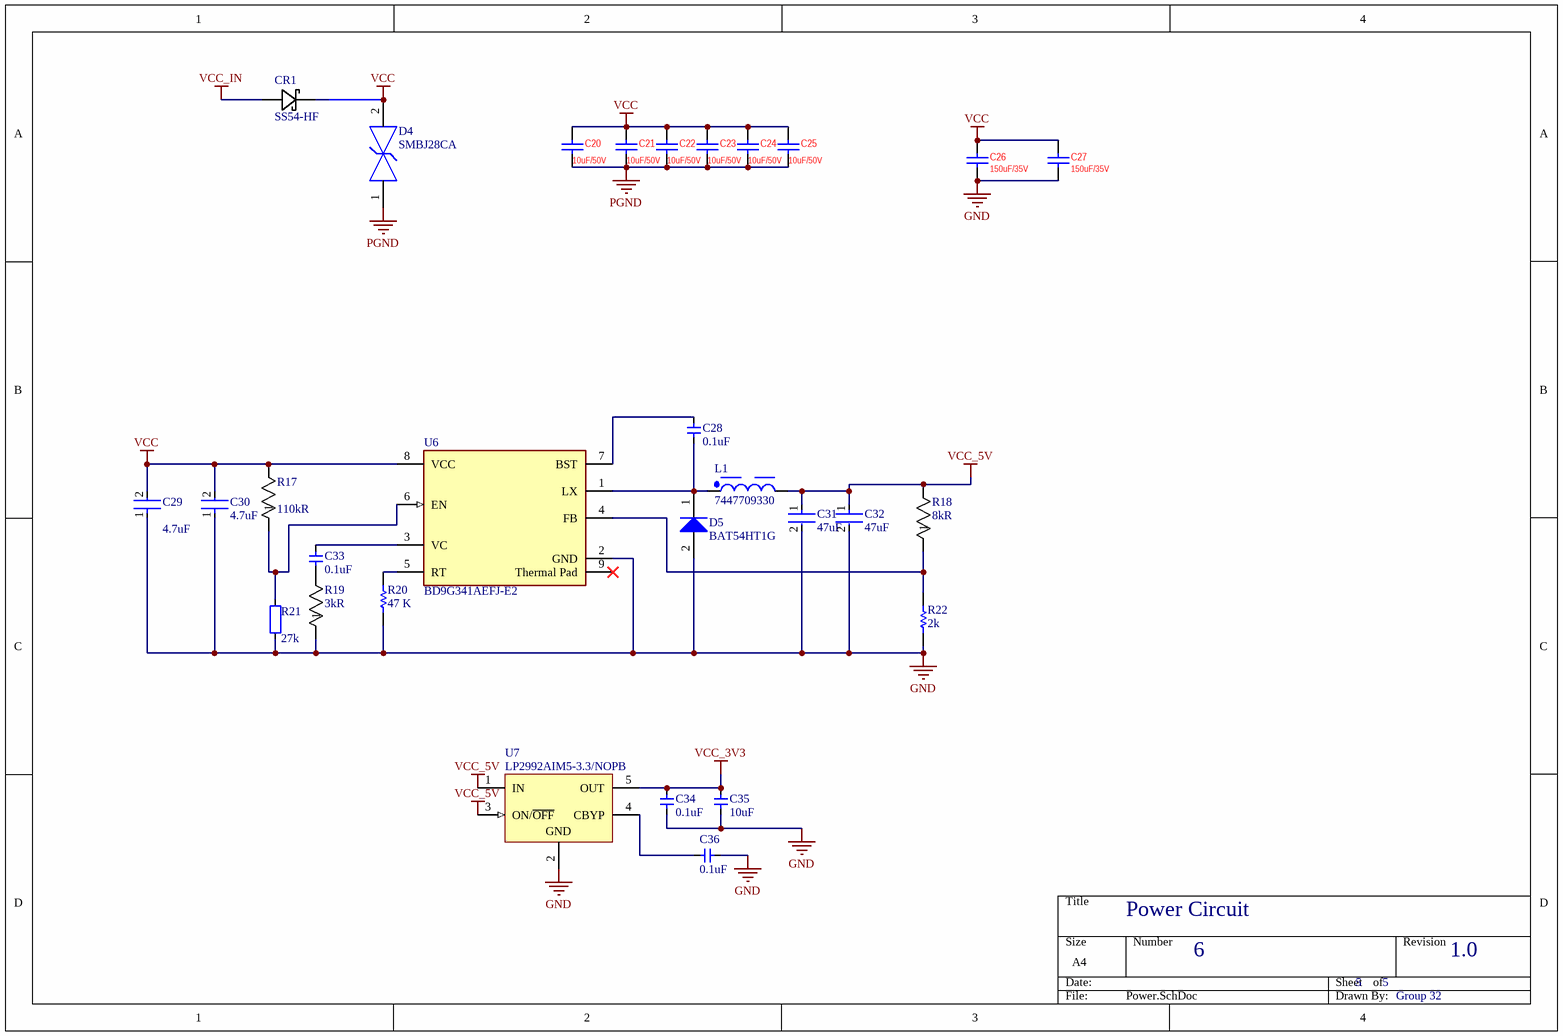
[diagram p5: Power.SchDoc]

### Parts
C20  10uF/50V  [CAPC3216X190N]
C21  10uF/50V  [CAPC3216X190N]
C22  10uF/50V  [CAPC3216X190N]
C23  10uF/50V  [CAPC3216X190N]
C24  10uF/50V  [CAPC3216X190N]
C25  10uF/50V  [CAPC3216X190N]
C26  value 150uF/35V  [CAP_EEEFK1V151AL]  (hidden comment: 220uF/25V)
C27  value 150uF/35V  [CAP_EEEFK1V151AL]  (hidden comment: 220uF/25V)
C28  0.1uF  [CAPC2013X94X50LL20T25]
C29  Capacitance: 4.7uF  [FP-1206-L_3_2_0_2-W_1_6_0-MFG]  (hidden comment: 12061Z475KAT2A)
C30  Capacitance: 4.7uF  [FP-1206-L_3_2_0_2-W_1_6_0-MFG]  (hidden comment: 12061Z475KAT2A)
C31  Capacitance: 47uF  [FP-C3216-160-0_2-IPC_C]  (hidden comment: C3216X6S0J476M160AB)
C32  Capacitance: 47uF  [FP-C3216-160-0_2-IPC_C]  (hidden comment: C3216X6S0J476M160AB)
C33  0.1uF  [CAPC2013X94X50LL20T25]
C34  0.1uF  [CAPC2013X94X50LL20T25]
C35  10uF  [CAPC2013X94X50LL20T25]
C36  0.1uF  [CAPC2013X94X50LL20T25]
CR1  SS54-HF  [SDO_DO-214AC_CIP]
D4  SMBJ28CA  [FP-SMBJ-CA-MFG]
D5  BAT54HT1G  [ONSC-SOD-323-2-477-02_V]
L1  7447709330  [WE-PD_1210]
R17  Resistance: 110kR  [RESC3116X65N]  (hidden comment: TNPW1206110KBEEA (2))
R18  Resistance: 8kR  [RESC3116X65N]  (hidden comment: MCA12060D8001BP500)
R19  Resistance: 3kR  [RESC2013X60X35NL10T20]  (hidden comment: TNPW12063K00BEEA)
R20  Resistance: 47 K  [RESC2013X60X35NL10T20]  (hidden comment: RC0805FR-0747KL)
R21  value 27k  [RESC2013X60X35NL10T20]
R22  R: 2k  [RESC2013X60X35NL10T20]  (hidden comment: RC0805FR-0710KL)
U6  BD9G341AEFJ-E2  [FP-HTSOP-J8-MFG]
U7  LP2992AIM5-3.3/NOPB  [MF05A_L]

### Nets
GND: C20.2 C21.2 C22.2 C23.2 C24.2 C25.2 C26.2 C27.2 C29.1 C30.1 C31.2 C32.2 C34.1 C35.1 C36.1 D4.1 D5.2(A) R19.1 R20.1 R21.1 R22.1 U6.2(GND) U7.2(GND)  [also labelled PGND]  [project net AGND]
VCC: C20.1 C21.1 C22.1 C23.1 C24.1 C25.1 C26.1 C27.1 C29.2 C30.2 CR1.1(CATHODE) D4.2 R17.2 U6.8(VCC)
VCC_3V3: C34.2 C35.2 U7.5(OUT)
VCC_5V: C31.1 C32.1 L1.2 R18.2 U7.1(IN) U7.3(ON/~{OFF})
VCC_IN: CR1.2(ANODE)
NetC28_1: C28.1 D5.1(K) L1.1 U6.1(LX)
NetC28_2: C28.2 U6.7(BST)
NetC33_1: C33.1 R19.2
NetC33_2: C33.2 U6.3(VC)
NetC36_2: C36.2 U7.4(CBYP)
NetR17_1: R17.1 R21.2 U6.6(EN)
NetR18_1: R18.1 R22.2 U6.4(FB)
NetR20_2: R20.2 U6.5(RT)

Not connected (* = marked no-connect by the designer): U6 9(Thermal_Pad)*

### Notes on the sheet
- Power Circuit
- 6
- 5
- 1.0
- Group 32

### Library data of the parts
C20-C27 = CAP: Capacitor, chip, ceramic; Parameters: E22 CAP; PN: RVT1E221M0607; Price: 0.038
  C20-C25: Value: 10uF/50V
C28 C33-C36 = 电容-0402: Capacitor; Value: 0.1u
C29 C30 = CMP-2000-05019-2: CAP CER 4.7UF 100V X7S 1206; Tolerance: 10%; Thickness: 0.075inch; Max Operating Temperature: 125°C; Termination: SMD/SMT; Dielectric: X7S; Case Code (Metric): 3216; Case/Package: 1206; Height: 0.5mm; Mount: Surface Mount; Voltage Rating (DC): 100V; Min Operating Temperature: -55°C; Package Quantity: 1; Length: 3.2mm; Voltage Rating: 100V; Lead Free: Lead Free; RoHS Compliant: Yes; Packaging: Tape and Reel; Weight: 0.000571oz; REACH SVHC: No SVHC; Case Code (Imperial): 1206; Width: 0.063inch; Depth: 1.6mm
C31 C32 = CMP-08246-006559-1: Multilayer Ceramic Capacitors 47uF ±20% 6.3V X6S SMD 1206; Insulation Resistance: 10GR; Dissipation Factor: 10%; Min Operating Temperature: -55°C; Package Quantity: 1; Case Code (Metric): 3216; Voltage Rating (DC): 6.3V; Thickness: 0.071inch; REACH SVHC: No SVHC; Dielectric Material: Ceramic; RoHS Compliant: Yes; Case/Package: 1206; Packaging: Tape and Reel; Width: 0.063inch; Weight: 0.000571oz; Radiation Hardening: No; Case Code (Imperial): 1206; Max Operating Temperature: 105°C; Depth: 1.6mm; Mount: Surface Mount; Lead Free: Lead Free; Voltage Rating: 6.3V; Termination: SMD/SMT; Tolerance: 20%; Dielectric: X6S; Series: C; Length: 3.2mm; Construction: Flat; Resistor Type: Ceramic; Height: 1.6mm
CR1 = SS54-HF: No Description Available; Mfr_Name: Comchip; Type: Diodes - Rectifiers, Single
D4 = CMP-08607-000057-1: TVS DIODE 28V 45.4V DO214AA; Manufacturer: Littelfuse Inc; Direction: Bidirectional; Peak Pulse Power: 600W; Max Junction Temp: +150°C; Peak Pulse Current: 13.3A; Breakdown Voltage: 31.1V; Number Of Channels: 1; Digikey Description: TVS DIODE 28V 45.4V DO214AA; Temperature Range Low: -65°C; Device Class L1: Circuit Protection; Automotive: No; Device Class L3: unset; Octopart: https://octopart.com/smbj28ca-littelfuse-350757; Temperature Range High: +150°C; Reverse Standoff Voltage: 28V; Mouser Description: In a Pack of 10, Littelfuse SMBJ28CA, Bi-Directional TVS Diode, 600W, 2-Pin DO-214AA; Category: Diode; Device Class L2: TVS Diodes; ComponentLink2URL: https://www.littelfuse.com/~/media/electronics/datasheets/tvs_diodes/littelfuse_tvs_diode_smbj_datasheet.pdf.pdf; Clamping Voltage: 45.4V; Manufacturer Part Number: SMBJ28CA; RoHS: TRUE; Height: 2.61mm; Package: SMBJ-CA; ComponentLink2Description: Datasheet; Lead Free: Yes; Temperature: -65°C to +150°C
D5 = CMP-1055-00462-1: Schottky Barrier Diode, 2-Pin SOD-323, Pb-Free, Tape and Reel; Manufacturer: On Semiconductor; Configuration: Single; trr Max (ns): 5; IFSM Max (A): 0.6; ComponentLink3URL: http://www.onsemi.com/pub_link/Collateral/477-02.PDF.1; PackageDescription: 2-Pin SOD, Body 1.7 x 1.25 mm; ComponentLink2URL: http://www.onsemi.cn/pub_link/Collateral/BAT54HT1-D.PDF; ComponentLink3Description: Package Specification; ComponentLink2Description: Datasheet; DatasheetVersion: Rev. 6; PackageReference: SOD-323-2-477-02; RoHS: TRUE; ComponentLink1URL: http://www.onsemi.com/; Packing: Tape and Reel; PartNumber: BAT54HT1G; Mounting Technology: Surface Mount; ComponentLink1Description: Manufacturer URL; PackageVersion: Rev. H, 03/2007
L1 = CMP-0227-00179-2: NexarPartId: 22866921; DC Resistance (DCR): 37mΩ; Inductance Tolerance: 20%; Self Resonant Frequency: 8.5MHz; Current Rating: 4.2A; Inductance: 33µH; Height: 10mm; Ambient Temperature Range High: 85°C; Number of Pins: 2; Width: 12mm; Min Operating Temperature: -40°C; Resistance: 37mΩ; Max Operating Temperature: 125°C; Ambient Temperature Range Low: -40°C; Packaging: Cut Tape (CT); RoHS: Compliant; Length: 12mm
R17 = TNPW1206110KBEEA (2): Fixed Resistor, Thin Film, 0.25W, 110000ohm, 200V, 0.1% +/-Tol, 25ppm/Cel, Surface Mount, 1206; Manufacturer: Vishay Dale; Rated Power Dissipation (P): 250mW; Rated Temperature: 70°C; Temperature Coefficient: 25ppm/°C; Package Height: 0.55mm; Package Length: 3.2mm; Package Width: 1.6mm; Reference Standard: AEC-Q200; Supplier 1: Mouser; Manufacturer Part Number: TNPW1206110KBEEA; RoHS: Yes; Category: Chip SMD Resistors; Stock 1: 19950; Pricing 1: 1=0.64, 10=0.458, 50=0.351, 100=0.311, 1000=0.202, 10000=0.191 (USD); Mount: Surface Mount; Number of Pins: 2; Size Code: 1206; Terminal Finish: Nickel; Min Operating Temperature: -55°C; Max Operating Temperature: 125°C; Tolerance: 0.1%; Resistor Type: FIXED RESISTOR; Construction: Chip; Package Style: SMTMeter; Packaging: Tape and Reel; Technology: THIN FILM; Termination: Wraparound; Working Voltage: 200V; Reach SVHC Compliant: Yes; RoHS Compliant: Yes; ComponentLink1URL: https://datasheet.ciiva.com:443/pdfs/VipMasterIC/IC/VISH/VISH-S-A0002290253/VISH-S-A0002290253-1.pdf?src-supplier=IHS+Markit; ComponentLink1Description: https://datasheet.ciiva.com:443/pdfs/VipMasterIC/IC/VISH/VISH-S-A0002290253/VISH-S-A0002290253-1.pdf?src-supplier=IHS+Markit; ComponentLink2URL: https://datasheet.ciiva.com/2607/tnpw-e3-2607341.pdf?src-supplier=Digikey; ComponentLink2Description: https://datasheet.ciiva.com/2607/tnpw-e3-2607341.pdf?src-supplier=Digikey; ComponentLink3URL: https://datasheet.ciiva.com/8978/tnpw-e3-8978104.pdf?src-supplier=Avnet; ComponentLink3Description: https://datasheet.ciiva.com/8978/tnpw-e3-8978104.pdf?src-supplier=Avnet
R18 = MCA12060D8001BP500: Fixed Resistor, Thin Film, 0.25W, 8000ohm, 200V, 0.1% +/-Tol, 25ppm/Cel, Surface Mount, 1206; Manufacturer: Vishay BCcomponents; Rated Power Dissipation (P): 250mW; Rated Temperature: 70°C; Temperature Coefficient: 25ppm/°C; Supplier 1: Digikey; Manufacturer Part Number: MCA12060D8001BP500; RoHS: Yes; Category: Chip SMD Resistors; Pricing 1: 5000=0.16835 (USD); Mount: Surface Mount; Number of Pins: 2; Package Shape: Rectangular; Size Code: 1206; Terminal Finish: Nickel; Min Operating Temperature: -55°C; Max Operating Temperature: 125°C; Tolerance: 0.1%; JESD-609 Code: e3; Resistor Type: FIXED RESISTOR; Packaging: Tape and Reel; Technology: THIN FILM; Termination: Wraparound; Working Voltage: 200V; Reach SVHC Compliant: Yes; RoHS Compliant: Yes; ComponentLink1URL: https://datasheet.ciiva.com:443/pdfs/VipMasterIC/IC/VISH/VISH-S-A0002473671/VISH-S-A0002473671-1.pdf?src-supplier=IHS+Markit; ComponentLink1Description: https://datasheet.ciiva.com:443/pdfs/VipMasterIC/IC/VISH/VISH-S-A0002473671/VISH-S-A0002473671-1.pdf?src-supplier=IHS+Markit; ComponentLink2URL: https://datasheet.ciiva.com/2606/mc-pre-2606068.pdf?src-supplier=Digikey; ComponentLink2Description: https://datasheet.ciiva.com/2606/mc-pre-2606068.pdf?src-supplier=Digikey
R19 = TNPW12063K00BEEA: Fixed Resistor, Thin Film, 0.25W, 3000ohm, 200V, 0.1% +/-Tol, 25ppm/Cel, Surface Mount, 1206; Manufacturer: Vishay Dale; Rated Power Dissipation (P): 250mW; Rated Temperature: 70°C; Temperature Coefficient: 25ppm/°C; Package Height: 0.55mm; Package Length: 3.2mm; Package Width: 1.6mm; Reference Standard: AEC-Q200; Supplier 1: Mouser; Manufacturer Part Number: TNPW12063K00BEEA; RoHS: Yes; Category: Chip SMD Resistors; Stock 1: 8904; Pricing 1: 1=0.64, 10=0.458, 50=0.351, 100=0.311, 1000=0.202, 10000=0.186 (USD); Mount: Surface Mount; Number of Pins: 2; Size Code: 1206; Terminal Finish: Nickel; Min Operating Temperature: -55°C; Max Operating Temperature: 125°C; Tolerance: 0.1%; Resistor Type: FIXED RESISTOR; Construction: Chip; Package Style: SMTMeter; Packaging: Tape and Reel; Technology: THIN FILM; Termination: Wraparound; Working Voltage: 200V; Reach SVHC Compliant: Yes; RoHS Compliant: Yes; ComponentLink1URL: https://datasheet.ciiva.com:443/pdfs/VipMasterIC/IC/VISH/VISH-S-A0002290253/VISH-S-A0002290253-1.pdf?src-supplier=IHS+Markit; ComponentLink1Description: https://datasheet.ciiva.com:443/pdfs/VipMasterIC/IC/VISH/VISH-S-A0002290253/VISH-S-A0002290253-1.pdf?src-supplier=IHS+Markit; ComponentLink2URL: http://www.mouser.com/ds/2/427/tnpw_e3-64594.pdf?src-supplier=Mouser; ComponentLink2Description: http://www.mouser.com/ds/2/427/tnpw_e3-64594.pdf?src-supplier=Mouser; ComponentLink3URL: http://www.vishay.com/docs/28758/tnpw_e3.pdf?src-supplier=Avnet; ComponentLink3Description: http://www.vishay.com/docs/28758/tnpw_e3.pdf?src-supplier=Avnet; ComponentLink4URL: http://www.vishay.com/docs/28758/tnpw_e3.pdf?src-supplier=Digikey; ComponentLink4Description: http://www.vishay.com/docs/28758/tnpw_e3.pdf?src-supplier=Digikey
R20 = CMP-1659-00011-4: Chip Resistor, 47 KOhm, +/- 1%, 0.125 W, -55 to 155 degC, 0805 (2012 Metric), RoHS, Tape and Reel; Manufacturer: Yageo; Voltage Rating: 150 V; Height: 0.5 mm; ComponentLink2URL: http://www.yageo.com/documents/recent/PYu-RC_Group_51_RoHS_L_04.pdf; ComponentLink2Description: Datasheet; Package Quantity: 200; Max Operating Temperature: 155 degC; Min Operating Temperature: -55 degC; Packaging: Tape and Reel; Pins: 2; PackageReference: 0805; Mounting Technology: Surface Mount; ComponentLink1Description: Manufacturer URL; ComponentLink1URL: http://www.yageo.com/; PackageDescription: 2-Pin Surface Mounted Device, Body 2 x 1.25 mm; Length: 2 mm; REACH SVHC: No SVHC; Mount: Surface Mount; RoHSCompliant: true; DatasheetVersion: Rev. 4, 02/2016
R21 = 电阻-1206: Resistor
R22 = CMP-1659-00013-4: Chip Resistor, 10 KOhm, +/- 1%, 0.125 W, -55 to 155 degC, 0805 (2012 Metric), RoHS, Tape and Reel; Manufacturer: Yageo; Voltage Rating: 150 V; REs: 10k; Mount: Surface Mount; ComponentLink1Description: Manufacturer URL; ComponentLink2URL: http://www.yageo.com/documents/recent/PYu-RC_Group_51_RoHS_L_04.pdf; Pins: 2; Length: 2 mm; Min Operating Temperature: -55 degC; Height: 0.5 mm; Mounting Technology: Surface Mount; RoHSCompliant: true; REACH SVHC: No SVHC; ComponentLink1URL: http://www.yageo.com/; Max Operating Temperature: 155 degC; PackageReference: 0805; DatasheetVersion: Rev. 4, 02/2016; Package Quantity: 5000; Packaging: Tape and Reel; ComponentLink2Description: Datasheet; PackageDescription: 2-Pin Surface Mounted Device, Body 2 x 1.25 mm
U6 = CMP-08938-000001-1: IC REG BUCK ADJ 3A 8HTSOP-J; Manufacturer: Rohm; Output Type: Fixed; Number Of Outputs: 1; Max Power Dissipation: 3.76W; Min Supply Voltage: 12V; Standoff Height: 0mm; Output Voltage: 1V; Max Supply Voltage: 76V; Switching Frequency: 50-750kHz; Max Junction Temp: +150°C; Nominal Supply Current: 1.5mA; Temperature Range High: +85°C; Height: 1mm; Temperature: -40°C to +85°C; Octopart: https://octopart.com/bd9g341aefj-e2-rohm-61817816; Device Class L1: Integrated Circuits (ICs); ComponentLink2Description: Datasheet; Manufacturer Part Number: BD9G341AEFJ-E2; RoHS: TRUE; Footprint Url: https://d1d2qsbl8m0m72.cloudfront.net/en/techdata_basic/ic/package/htsop-j8_1-e.pdf; Temperature Range Low: -40°C; Device Class L2: Power Management ICs; Switching Topology: Buck; Output Current: 3A; Device Class L3: Voltage Regulators - Switching; Package: HTSOP-J8; ComponentLink2URL: https://www.rohm.com/datasheet/BD9G341AEFJ/bd9g341aefj-e; Automotive: No; Ipc Land Pattern Name: SOIC127P600X100-8; Digikey Description: IC REG BUCK ADJ 3A 8HTSOP-J; Category: IC; Lead Free: Yes
U7 = CMP-0062-02136-2: Micropower 250 mA Low-Noise Ultra Low-Dropout Regulator, 5-pin SOT-23, Pb-Free; Manufacturer: National Semiconductor; PowerWise: N; PackageTopMarking: LFEA*XTT; CompType: LDO IC; ComponentLink2Description: LP2992 Web Page; ComponentLink3Description: MF05A Package Page; PackageVersion: revD, Aug-2008; RoHS: Y; ComponentLink1Description: LP2992 Datasheet; DatasheetVersion: May-2005; PackageReference: MF05A; PackageDescription: Molded SOT-23, .115 x .063 x .040 in Body, 5 Lead, .0375 in Pitch; ComponentLink1URL: http://www.national.com/ds/LP/LP2992.pdf; ComponentLink3URL: http://www.national.com/packaging/folders/mf05a.html; RevisionNote: Component URLs added; PinCount: 5; ComponentLink2URL: http://www.national.com/pf/LP/LP2992.html

## Nets that join several sheets
AGND: MCU (17 pins), Drive (16 pins), Interface (8 pins), Port (17 pins), Power (23 pins)
VCC: Drive (6 pins), Interface (R9.1), Power (14 pins)
VCC_3V3: MCU (14 pins), Drive (R4.2), Interface (5 pins), Port (C19.2 U5.3), Power (C34.2 C35.2 U7.5)
VCC_5V: MCU (P1.4), Interface (C41.2 C42.2 J1.1 XA1.2), Power (6 pins)
VCC_IN: Port (XA7.1 XA7.2 XA10.1 XA10.2), Power (CR1.2)
NetC10_2: MCU (U4.10), Interface (C10.2 R9.2 R10.1)
NetC38_2: MCU (U4.11), Drive (C38.2 R4.1 R7.2)
NetJ1_5: MCU (U4.39), Interface (J1.5 XA3.1)
NetJ1_6: MCU (U4.40), Interface (J1.6 XA3.2)
NetJ1_7: MCU (U4.41), Interface (J1.7 XA4.1)
NetJ2_8: MCU (U4.29), Port (J2.8 SW1.3P1)
NetJ2_9: MCU (U4.30), Port (J2.9 SW1.2P1)
NetJ2_10: MCU (U4.31), Port (J2.10 SW1.1P1)
NetJ3_2: MCU (U4.43), Port (J3.2 XA13.2)
NetJ3_3: MCU (U4.42), Port (J3.3 XA13.1)
NetJ3_4: MCU (U4.34), Port (J3.4 XA12.1)
NetJ3_5: MCU (U4.37), Port (J3.5 XA11.2)
NetR2_1: MCU (U4.22), Drive (R2.1)
NetR5_1: MCU (U4.21), Drive (R5.1)
NetS2_4: MCU (U4.25), Port (S2.4)
NetS3_4: MCU (U4.20), Port (S3.4)
NetU1_2: MCU (U4.14), Drive (U1.2)
NetU1_3: MCU (U4.15), Drive (U1.3)
NetU2_2: MCU (U4.12), Drive (U2.2)
NetU2_3: MCU (U4.13), Drive (U2.3)
NetU4_45: MCU (U4.45), Port (U5.4)
NetU4_46: MCU (U4.46), Port (U5.1)